# Altium schematic sheet TIASch.SchDoc: Transimpedance Amplifier Schematic
size A; DrawnBy: Enrique Morell; DocumentNumber: 3; Revision: v0.1; SheetNumber: 3; SheetTotal: 9
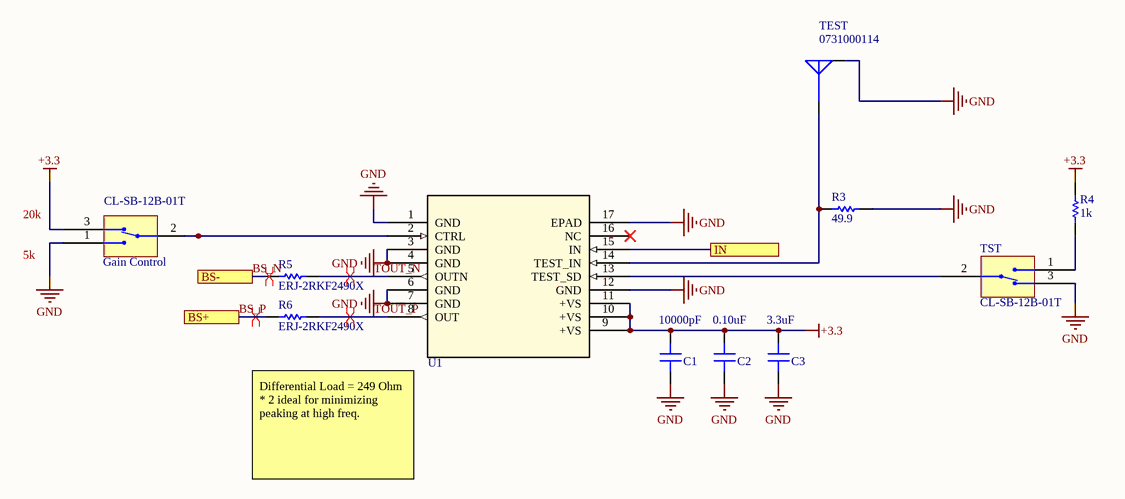
[diagram p0: TIASch.SchDoc]

## Parts
C1  10000pF  [CAP 0402/1005]
C2  0.10uF  [CAP 0402/1005]
C3  3.3uF  [CAP 0805/2012]
Gain_Control  CL-SB-12B-01T  [SW_CL-SB-12B-01]
R3  49.9  [RESC1005X40X25NL05T05]
R4  1k  [RESC1005X40X25NL05T05]
R5  ERJ-2RKF2490X  [RESC1005X40X25NL05T05]
R6  ERJ-2RKF2490X  [RESC1005X40X25NL05T05]
TEST  0731000114  [MOLEX SD-73100-0114]
TST  CL-SB-12B-01T  [SW_CL-SB-12B-01]
U1  OPA857  [TI VQFN-16 (3x3)]  (value not drawn)

## Ports
BS+, BS-, IN

## Nets
+3.3: C1.2 C2.2 C3.2 Gain_Control.3(GND) R4.1 U1.9(+VS) U1.10(+VS) U1.11(+VS)
GND: C1.1 C2.1 C3.1 Gain_Control.1(GND) R3.2 TEST.G TST.3(GND) U1.1(GND) U1.3(GND) U1.4(GND) U1.6(GND) U1.7(GND) U1.12(GND) U1.17(EPAD)
BS_N: R5.1 ; port BS-
BS_P: R6.1 ; port BS+
IN: U1.15(IN) ; port IN
TOUT_N: R5.2 U1.5(OUTN)
TOUT_P: R6.2 U1.8(OUT)
NetGain_Control_2: Gain_Control.2(GND) U1.2(CTRL)
NetR3_1: R3.1 TEST.S U1.14(TEST_IN)
NetR4_2: R4.2 TST.1(GND)
NetTST_2: TST.2(GND) U1.13(TEST_SD)

Not connected (* = marked no-connect by the designer): U1 16(NC)*

## Layout directives
differential pair: BS_N, BS_P, TOUT_N, TOUT_P

## Notes on the sheet
- 20k
- 5k
- Differential Load = 249 Ohm * 2 ideal for minimizing peaking at high freq.

## Library data of the parts
C1 = C0402C103J4RACTU: CAP CER 10000PF 16V X7R 0402; Manufacturer: Kemet; TemperatureRange: -55C ~ 125C; Tolerance: 5%; Value: 10000pF; Part Number: C0402C103J4RACTU; PartId: 12588; Supplier 1: Digi-Key; Supplier Part Number 1: 399-1039-2-ND; ComponentLink1Description: Datasheet; ComponentLink1URL: http://www.kemet.com/docfinder?Partnumber=C0402C103J4RACTU; ComponentLink2Description: Digi-Key Listing; ComponentLink2URL: https://www.digikey.com/product-detail/en/kemet/C0402C103J4RACTU/399-1039-2-ND/411041; TemperatureCoefficient: X7R; Voltage: 16V; Price: 0.0784; Device Package: 0402 (1005 Metric)
C2 = GRM155R71C104JA88D: CAP CER 0.1UF 16V X7R 0402; Manufacturer: Murata Electronics North America; TemperatureRange: -55C ~ 125C; Tolerance: 5%; Value: 0.10uF; Part Number: GRM155R71C104JA88D; PartId: 12366; Supplier 1: Digi-Key; Supplier Part Number 1: 490-6327-2-ND; ComponentLink1Description: Datasheet; ComponentLink1URL: http://www.murata.com/~/media/webrenewal/support/library/catalog/products/capacitor/mlcc/c02e.pdf; ComponentLink2Description: Digi-Key Listing; ComponentLink2URL: https://www.digikey.com/product-detail/en/murata-electronics-north-america/GRM155R71C104JA88D/490-6327-2-ND/2610891; TemperatureCoefficient: X7R; Voltage: 16V; Price: 0.0046; Device Package: 0402 (1005 Metric)
C3 = C2012X7R1C335K125AB: CAP CER 3.3UF 16V X7R 0805; Manufacturer: TDK Corporation; TemperatureRange: -55C ~ 125C; Tolerance: 10%; Value: 3.3uF; Part Number: C2012X7R1C335K125AB; PartId: 4679; Supplier 1: Digi-Key; Supplier Part Number 1: 445-7582-2-ND; ComponentLink1Description: Datasheet; ComponentLink1URL: https://product.tdk.com/info/en/catalog/datasheets/mlcc_commercial_general_en.pdf; ComponentLink2Description: Digi-Key listing; ComponentLink2URL: http://digikey.com/product-detail/en/C2012X7R1C335K125AB/445-7582-2-ND/2733017; TemperatureCoefficient: X7R; Voltage: 16V; Price: 0.1162; Type: -; Device Package: 0805 (2012 Metric)
Gain_Control TST = CL-SB-12B-01T: SWITCH SLIDE SPDT 200MA 12V; Manufacturer: Nidec Copal Electronics; Switch Function: On-On; Actuator Type: Standard; Switch Travel: 2.00mm; Mechanical Life: 10,000 Cycles; Part Number: CL-SB-12B-01T; PartId: 16472; Supplier 1: Digi-Key; Supplier Part Number 1: 563-1318-1-ND; ComponentLink1Description: Datasheet; ComponentLink1URL: https://www.nidec-copal-electronics.com/e/catalog/switch/cl-sb.pdf; ComponentLink2Description: Digi-Key Listing; ComponentLink2URL: https://www.digikey.com/product-detail/en/nidec-copal-electronics/CL-SB-12B-01T/563-1318-1-ND/3507878; Price: 0.9; TYPE: Slide Switches; Series: CL-SB; Circuit: SPDT; Operating Temperature: -40°C ~ 85°C
R3 = CMP-2002-00969-1: Manufacturer: Panasonic; Part Number: ERJ-2RKF49R9X
R4 = CMP-2002-00606-3: Chip Resistor, 1 KOhm, +/- 1%, 100 mW, -55 to 155 degC, 0402 (1005 Metric), RoHS, Tape and Reel; PartNumber: ERJ-2RKF1001X; Manufacturer: Basic Passives; Voltage Rating: 50 V; Case\/Package: 0402; Resistance: 1 KOhm; Power Rating: 100 mW; DatasheetVersion: 04/2015; Radiation Hardening: No; Pins: 2; Height: 0.35 mm; RoHSCompliant: true; Case Code (Imperial): 0402; ComponentLink2Description: Datasheet; ComponentLink1Description: Manufacturer URL; PackageReference: 0402; Mount: Surface Mount; Package Quantity: 10000; Tolerance: 1%; ComponentLink1URL: http://www.panasonic.com/; PackageDescription: 2-Pin Surface Mount Device, Body 1 x 0.5 mm; Mounting Technology: Surface Mount; Case Code (Metric): 1005; ComponentLink2URL: http://industrial.panasonic.com/cdbs/www-data/pdf/RDA0000/AOA0000C86.pdf; REACH SVHC: Yes; Packaging: Tape and Reel; Max Operating Temperature: 155 degC; Min Operating Temperature: -55 degC; Width: 0.5 mm; Length: 1 mm
R5 R6 = CMP-2002-00804-1: Manufacturer: Panasonic; Part Number: ERJ-2RKF2490X
TEST = 0731000114: CONN SMA RCPT R/A 50 OHM PCB; Manufacturer: Molex; Impedance: 50 Ohm; Body Finish: Gold; Body Material: Brass; Contact Termination: Solder; Dielectric Material: Polytetrafluoroethylene (PTFE); Voltage Rating: 500V; Center Contact Material: Gold; Center Contact Plating: Gold; ComponentLink1Description: Datasheet; ComponentLink1URL: https://www.molex.com/pdm_docs/sd/731000114_sd.pdf; ComponentLink2Description: Digi-Key Listing; ComponentLink2URL: https://www.digikey.com/product-detail/en/molex/0731000114/WM5525-ND/1465147; Fastening Type: Threaded; Housing Colour: Gold; Mounting Type: Through Hole, Right Angle; Operating Temperature: -65°C ~ 165°C; PartId: 16436; Part Number: 0731000114; Price: 5.14; Series: 73100; Shield Termination: Solder; Style: SMA; Supplier 1: Digi-Key; Supplier Part Number 1: WM5525-ND; Type: Receptacle, Female Socket
U1 = OPA857: IC OPAMP GP 1 CIRCUIT 16VQFN; Vendor: Texas Instruments; Built_By: EMA_UL_Team; Frequency - Transition: 130Mhz; Manufacturer_Part_Number: OPA857IRGTT; Copyright: Copyright (C) 2018 Accelerated Designs. All rights reserved; RefDes: RefDes; Type: DEV; Value: Value; Part Number: OPA857; PartId: 9797; Manufacturer: Texas Instruments; Supplier 1: Digi-Key; Supplier Part Number 1: 296-37283-1-ND; ComponentLink1Description: Datasheet; ComponentLink1URL: http://www.ti.com/lit/ds/symlink/opa857.pdf; ComponentLink2Description: Digi-Key Listing; ComponentLink2URL: https://www.digikey.com/product-detail/en/texas-instruments/OPA857IRGTT/296-37283-1-ND/4733032; Device Package: 16-VFQFN Exposed Pad; Price: 6.43; Series: -